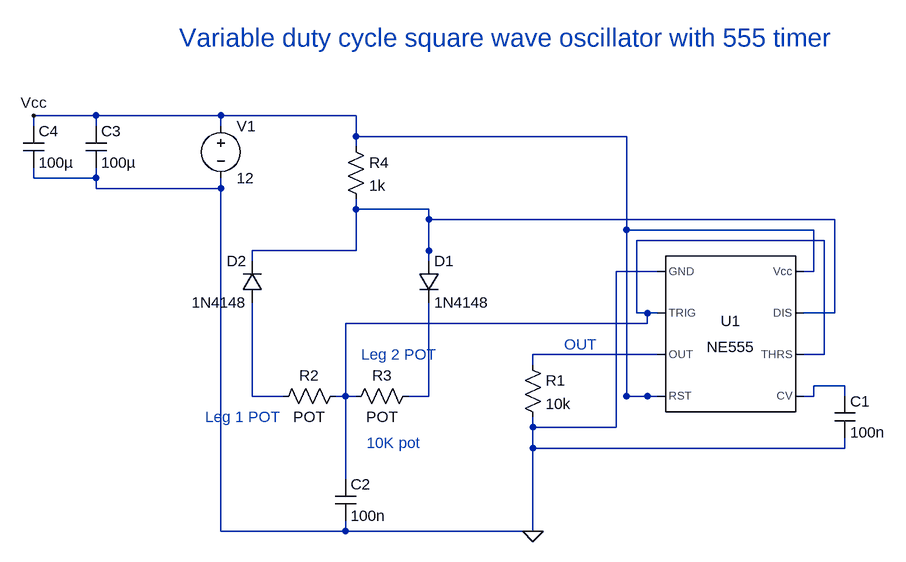
[diagram p0: schematic Adjustable-duty-cycle-555-square-wave-oscillator.asc]
Adjustable-duty-cycle-555-square-wave-oscillator.asc, the LTspice schematic file:
Version 4.1
SHEET 1 1012 680
WIRE 384 336 384 352
WIRE -384 464 -384 480
WIRE -768 -80 -768 -64
WIRE -864 -80 -864 -64
WIRE -96 304 -96 320
WIRE 96 80 80 80
WIRE -576 -64 -576 -48
WIRE 384 352 -96 352
WIRE -96 352 -96 320
WIRE -96 320 32 320
WIRE 32 320 32 80
WIRE 32 80 80 80
WIRE -96 320 -96 480
WIRE -96 480 -384 480
WIRE -384 480 -576 480
WIRE -576 480 -576 -48
WIRE -576 -48 -768 -48
WIRE -768 -48 -768 -64
WIRE -768 -64 -864 -64
FLAG -96 480 0
WIRE -256 64 -256 48
WIRE -528 64 -528 48
WIRE -368 -32 -368 -16
WIRE 320 144 336 144
WIRE -256 48 -256 -16
WIRE -256 -16 -368 -16
WIRE -368 -16 -368 48
WIRE -368 48 -528 48
WIRE -256 48 -256 0
WIRE -256 0 368 0
WIRE 368 0 368 144
WIRE 368 144 336 144
WIRE -384 400 -384 384
WIRE -400 272 -384 272
WIRE -368 272 -384 272
WIRE 96 144 80 144
WIRE 320 208 336 208
WIRE -384 384 -384 272
WIRE -384 272 -384 160
WIRE -384 160 80 160
WIRE 80 160 80 144
WIRE 80 144 64 144
WIRE 64 144 64 32
WIRE 64 32 352 32
WIRE 352 32 352 208
WIRE 352 208 336 208
WIRE -96 224 -96 208
WIRE 96 208 80 208
WIRE -96 208 80 208
WIRE -528 128 -528 144
WIRE -480 272 -496 272
WIRE -528 144 -528 272
WIRE -528 272 -496 272
WIRE -256 128 -256 144
WIRE -288 272 -272 272
WIRE -256 144 -256 272
WIRE -256 272 -272 272
WIRE 384 272 384 256
WIRE 320 272 336 272
WIRE 384 256 336 256
WIRE 336 256 336 272
WIRE -768 -144 -768 -160
WIRE -864 -144 -864 -160
WIRE -368 -112 -368 -128
WIRE 96 272 80 272
WIRE 320 80 336 80
WIRE -576 -144 -576 -160
WIRE -768 -160 -864 -160
WIRE -768 -160 -576 -160
WIRE -576 -160 -368 -160
WIRE -368 -160 -368 -128
WIRE -368 -128 48 -128
WIRE 48 -128 48 272
WIRE 48 272 80 272
WIRE 80 272 48 272
WIRE 48 272 48 16
WIRE 48 16 336 16
WIRE 336 16 336 80
FLAG -864 -160 Vcc
SYMBOL Misc\\NE555 208 176 R0
SYMATTR InstName U1
SYMBOL voltage -576 -160 R0
WINDOW 123 0 0 Left 0
WINDOW 39 0 0 Left 0
SYMATTR InstName V1
SYMATTR Value 12
SYMBOL res -112 208 R0
SYMATTR InstName R1
SYMATTR Value 10k
SYMBOL cap 368 272 R0
SYMATTR InstName C1
SYMATTR Value 100n
SYMBOL diode -272 64 R0
SYMATTR InstName D1
SYMATTR Value 1N4148
SYMBOL diode -512 128 R180
WINDOW 0 24 64 Left 2
WINDOW 3 24 0 Left 2
SYMATTR InstName D2
SYMATTR Value 1N4148
SYMBOL res -384 256 R90
WINDOW 0 0 56 VBottom 2
WINDOW 3 32 56 VTop 2
SYMATTR InstName R2
SYMATTR Value POT
SYMBOL res -272 256 R90
WINDOW 0 0 56 VBottom 2
WINDOW 3 32 56 VTop 2
SYMATTR InstName R3
SYMATTR Value POT
SYMBOL cap -400 400 R0
SYMATTR InstName C2
SYMATTR Value 100n
SYMBOL res -384 -128 R0
SYMATTR InstName R4
SYMATTR Value 1k
SYMBOL cap -784 -144 R0
SYMATTR InstName C3
SYMATTR Value 100µ
SYMBOL cap -880 -144 R0
SYMATTR InstName C4
SYMATTR Value 100µ
TEXT -600 304 Left 2 ;Leg 1 POT
TEXT -360 208 Left 2 ;Leg 2 POT
TEXT -640 -280 Left 4 ;Variable duty cycle square wave oscillator with 555 timer
TEXT -48 192 Left 2 ;OUT
TEXT -352 344 Left 2 ;10K pot

The netlist it stands for:
* Adjustable-duty-cycle-555-square-wave-oscillator.asc
X§U1 0 N002 N003 Vcc N006 N002 N001 Vcc NE555  ; pins GND TRIG OUT RST CV THRS DIS Vcc
V1 Vcc 0 12
R1 N003 0 10k
C1 N006 0 100n
D1 N001 N005 1N4148
D2 N004 N001 1N4148
R2 N002 N004 POT
R3 N005 N002 POT
C2 N002 0 100n
R4 Vcc N001 1k
C3 Vcc 0 100µ
C4 Vcc 0 100µ
.model D D
.lib standard.dio
* Leg 1 POT
* Leg 2 POT
* Variable duty cycle square wave oscillator with 555 timer
* OUT
* 10K pot
.lib NE555.sub
.backanno
.end